# Altium schematic sheet haptic_hands.SchDoc
size A3; SheetNumber: 1; SheetTotal: 1; SPICEModelCacheEDLRRATN: <root> / <DocumentId>EDLRRATN</DocumentId> / <CacheFrame Number="0"> / <Model Name="2n3904" Kind="MDL"> / <Text>*2N3904 / *Si 310mW  40V 200mA 300MHz pkg:TO-92B 1,2,3 / .MODEL 2N3904 NPN(IS=1.4E-14 BF=300 VAF=100 IKF=0.025 ISE=3E-13 / + BR=7.5 RC=2.4 CJE=4.5E-12 TF=4E-10 CJC=3.5E-12 TR=2.1E-8 XTB=1.5 KF=9E-16 )</Text> / </Model> / </CacheFrame> / </root>
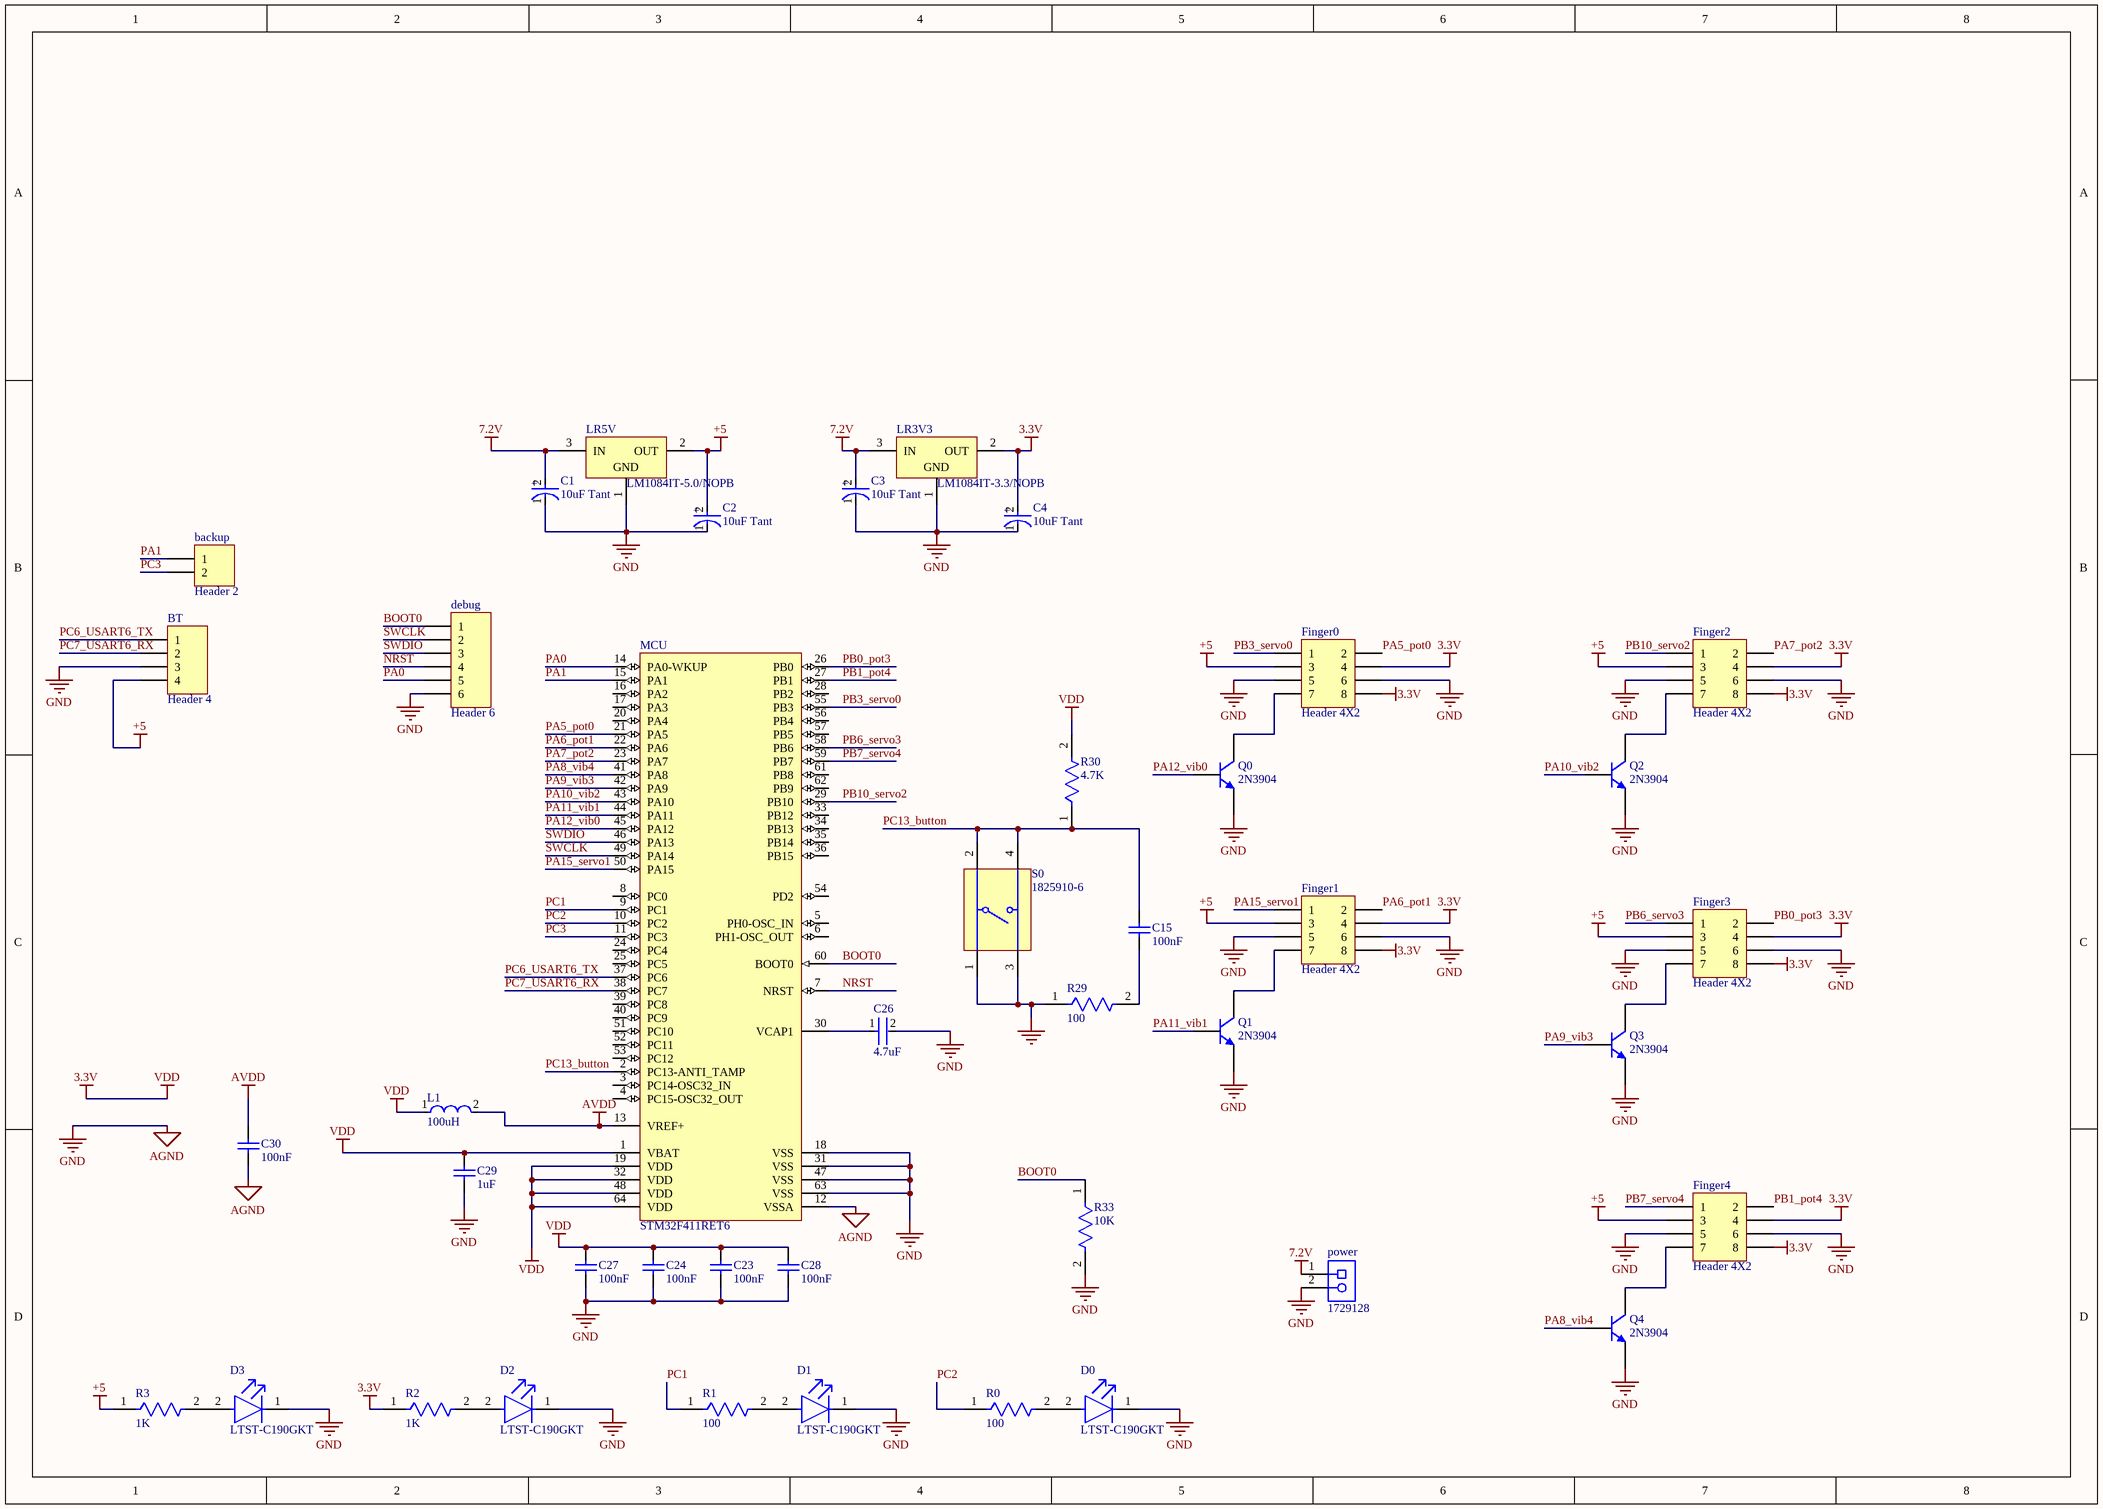
[diagram p0: haptic_hands.SchDoc]

## Parts
backup  Header 2  [HDR1X2]
BT  Header 4  [HDR1X4]
C1  10uF Tant  [FP-T491A105K016AT-MFG]
C2  10uF Tant  [FP-T491A105K016AT-MFG]
C3  10uF Tant  [FP-T491A105K016AT-MFG]
C4  10uF Tant  [FP-T491A105K016AT-MFG]
C15  100nF  [CAPC1608X92X38NL15T08]
C23  100nF  [CAPC1608X92X38NL15T08]
C24  100nF  [CAPC1608X92X38NL15T08]
C26  4.7uF  [FP-GCJ31C-0_3-IPC_A]
C27  100nF  [CAPC1608X92X38NL15T08]
C28  100nF  [CAPC1608X92X38NL15T08]
C29  1uF  [CAPC1005X56X25ML10T15]
C30  100nF  [CAPC1608X92X38NL15T08]
D0  LTST-C190GKT  [FP-LTST-C190GKT-MFG]
D1  LTST-C190GKT  [FP-LTST-C190GKT-MFG]
D2  LTST-C190GKT  [FP-LTST-C190GKT-MFG]
D3  LTST-C190GKT  [FP-LTST-C190GKT-MFG]
debug  Header 6  [HDR1X6]
Finger0  Header 4X2  [HDR2X4]
Finger1  Header 4X2  [HDR2X4]
Finger2  Header 4X2  [HDR2X4]
Finger3  Header 4X2  [HDR2X4]
Finger4  Header 4X2  [HDR2X4]
L1  100uH  [FP-LBM2016-1_6-0_2-IPC_A]
LR3V3  LM1084IT-3.3/NOPB  [NDE0003A]
LR5V  LM1084IT-5.0/NOPB  [NDE0003A]
MCU  STM32F411RET6  [STM-LQFP64_L]
power  1729128  [PHOE-1729128-2_V]
Q0  2N3904  [TO-92A]
Q1  2N3904  [TO-92A]
Q2  2N3904  [TO-92A]
Q3  2N3904  [TO-92A]
Q4  2N3904  [TO-92A]
R0  100  [FP-CR1206-IPC_A]
R1  100  [FP-CR1206-IPC_A]
R2  1K  [FP-CR1206-IPC_A]
R3  1K  [FP-CR1206-IPC_A]
R29  100  [FP-CR1206-IPC_A]
R30  4.7K  [FP-CR1206-IPC_A]
R33  10K  [FP-CR1206-IPC_A]
S0  1825910-6  [TECO-1825910-6_V]

## Nets
3.3V: C4.2(A) C23.2 C24.2 C27.2 C28.2 C29.2 Finger0.4 Finger0.8 Finger1.4 Finger1.8 Finger2.4 Finger2.8 Finger3.4 Finger3.8 Finger4.4 Finger4.8 L1.1 LR3V3.2(OUT) MCU.1(VBAT) MCU.19(VDD) MCU.32(VDD) MCU.48(VDD) MCU.64(VDD) R2.1 R30.2  [also labelled VDD]
7.2V: C1.2(A) C3.2(A) LR3V3.3(IN) LR5V.3(IN) power.1
+5: BT.4 C2.2(A) Finger0.3 Finger1.3 Finger2.3 Finger3.3 Finger4.3 LR5V.2(OUT) R3.1
AGND: BT.3 C1.1(C) C2.1(C) C3.1(C) C4.1(C) C23.1 C24.1 C26.2 C27.1 C28.1 C29.1 C30.1 D0.1(C) D1.1(C) D2.1(C) D3.1(C) debug.6 Finger0.5 Finger0.6 Finger1.5 Finger1.6 Finger2.5 Finger2.6 Finger3.5 Finger3.6 Finger4.5 Finger4.6 LR3V3.1(GND) LR5V.1(GND) MCU.12(VSSA) MCU.18(VSS) MCU.31(VSS) MCU.47(VSS) MCU.63(VSS) power.2 Q0.1(E) Q1.1(E) Q2.1(E) Q3.1(E) Q4.1(E) R29.1 R33.2 S0.1 S0.3  [also labelled GND]
AVDD: C30.2 L1.2 MCU.13(VREF+)
BOOT0: debug.1 MCU.60(BOOT0) R33.1
NRST: debug.4 MCU.7(NRST)
PA0: debug.5 MCU.14(PA0-WKUP)
PA1: backup.1 MCU.15(PA1)
PA5_pot0: Finger0.2 MCU.21(PA5)
PA6_pot1: Finger1.2 MCU.22(PA6)
PA7_pot2: Finger2.2 MCU.23(PA7)
PA8_vib4: MCU.41(PA8) Q4.2(B)
PA9_vib3: MCU.42(PA9) Q3.2(B)
PA10_vib2: MCU.43(PA10) Q2.2(B)
PA11_vib1: MCU.44(PA11) Q1.2(B)
PA12_vib0: MCU.45(PA12) Q0.2(B)
PA15_servo1: Finger1.1 MCU.50(PA15)
PB0_pot3: Finger3.2 MCU.26(PB0)
PB1_pot4: Finger4.2 MCU.27(PB1)
PB3_servo0: Finger0.1 MCU.55(PB3)
PB6_servo3: Finger3.1 MCU.58(PB6)
PB7_servo4: Finger4.1 MCU.59(PB7)
PB10_servo2: Finger2.1 MCU.29(PB10)
PC1: MCU.9(PC1) R1.1
PC2: MCU.10(PC2) R0.1
PC3: backup.2 MCU.11(PC3)
PC6_USART6_TX: BT.1 MCU.37(PC6)
PC7_USART6_RX: BT.2 MCU.38(PC7)
PC13_button: C15.2 MCU.2(PC13-ANTI_TAMP) R30.1 S0.2 S0.4
SWCLK: debug.2 MCU.49(PA14)
SWDIO: debug.3 MCU.46(PA13)
NetC15_1: C15.1 R29.2
NetC26_1: C26.1 MCU.30(VCAP1)
NetD0_2: D0.2(A) R0.2
NetD1_2: D1.2(A) R1.2
NetD2_2: D2.2(A) R2.2
NetD3_2: D3.2(A) R3.2
NetFinger0_7: Finger0.7 Q0.3(C)
NetFinger1_7: Finger1.7 Q1.3(C)
NetFinger2_7: Finger2.7 Q2.3(C)
NetFinger3_7: Finger3.7 Q3.3(C)
NetFinger4_7: Finger4.7 Q4.3(C)

Not connected (* = marked no-connect by the designer): MCU 3(PC14-OSC32_IN) 4(PC15-OSC32_OUT) 5(PH0-OSC_IN) 6(PH1-OSC_OUT) 8(PC0) 16(PA2) 17(PA3) 20(PA4) 24(PC4) 25(PC5) 28(PB2) 33(PB12) 34(PB13) 35(PB14) 36(PB15) 39(PC8) 40(PC9) 51(PC10) 52(PC11) 53(PC12) 54(PD2) 56(PB4) 57(PB5) 61(PB8) 62(PB9)

## Notes on the sheet
- (in symbol CMP-2000-07186-2) +

## Library data of the parts
backup = Header 2: Header, 2-Pin; LatestRevisionDate: 17-Jul-2002; LatestRevisionNote: Re-released for DXP Platform.; Publisher: Altium Limited
BT = Header 4: Header, 4-Pin; LatestRevisionDate: 17-Jul-2002; LatestRevisionNote: Re-released for DXP Platform.; Publisher: Altium Limited
C1-C4 = CMP-2000-07186-2: 10uF TANTALUM / T494A106K016AT; Tolerance: 20%; Ripple Current: 87mA; Capacitance: 1uF; Voltage: 16V; Life (Hours): 2000Hour; Dissipation Factor: 4%; ESR (Equivalent Series Resistance): 10R; Leakage Current: 500nA; Polarity: Polar; Lead Free: Lead Free; Min Operating Temperature: -55°C; Number of Pins: 2; Dielectric Material: Tantalum; Mount: Surface Mount; Voltage Rating: 16V; Case Code (Imperial): 1206; Length: 3.2mm; Height: 1.6mm; Features: General Purpose; Max Operating Temperature: 125°C; Package Quantity: 1; REACH SVHC: No SVHC; Termination: SMD/SMT; Depth: 1.6mm; Width: 1.6mm; Packaging: Tape and Reel; Case Code (Metric): 3216; Case/Package: 1206; Voltage Rating (DC): 16V; Height - Seated (Max): 0.071inch
C15 C23 C24 C27 C28 C30 = CMP-2006-01975-1: Manufacturer: Vitramon; Part Number: VJ0603Y104KXAAC
C26 = CMP-06035-047309-1: Cap Ceramic 4.7uF 25V X7R 10% Pad SMD 1206 Soft Termination  +125°C Automotive T/R; Max Operating Temperature: 125°C; Mount: Surface Mount; Capacitance: 4.7uF; Features: Soft Termination; Thickness: 0.075inch; Dielectric: X7R; Tolerance: 10%; Termination: SMD/SMT; Ratings: AEC-Q200; Length: 0.126inch; Case Code (Imperial): 1206; Voltage Rating (DC): 25V; Lead Free: Lead Free; Case Code (Metric): 3216; Package Quantity: 2000; Min Operating Temperature: -55°C; Case/Package: 1206; Width: 0.063inch; Voltage Rating: 25V; Packaging: Tape and Reel; Depth: 1.6mm
C29 = CMP-2008-02844-1: Part Number: 0402YD105KAT2A; Manufacturer: AVX Interconnect / Elco
D0-D3 = CMP-22017-000005-2: LED GREEN CLEAR CHIP SMD; Dominant Wavelength: 569nm; Reverse Voltage: 5V; Lens Color: Colorless; Viewing Angle: 130°; Voltage: 2V; Forward Current: 30mA; Power Dissipation: 100mW; Luminous Intensity: 6mcd; Number of LEDs: 1; Forward Voltage: 2.1V; Wavelength: 565nm; Test Current: 10mA; Min Operating Temperature: -55°C; Lens Style: Clear; Mount: Surface Mount; Width: 0.8mm; Packaging: Tape and Reel; Lens Transparency: Clear; Case Code (Metric): 1608; Depth: 0.8mm; Case Code (Imperial): 0603; Case/Package: 0603; Number of Pins: 2; Max Operating Temperature: 85°C; Lead Free: Lead Free; Number of Elements: 1; Length: 1.6mm; Height: 0.8mm; Package Quantity: 1; Power Rating: 100mW; Radiation Hardening: No; Illumination Color: Green; Color: Green
debug = Header 6: Header, 6-Pin; LatestRevisionDate: 17-Jul-2002; LatestRevisionNote: Re-released for DXP Platform.; Publisher: Altium Limited
Finger0-Finger4 = Header 4X2: Header, 4-Pin, Dual row; LatestRevisionDate: 17-Jul-2002; LatestRevisionNote: Re-released for DXP Platform.; Publisher: Altium Limited
L1 = CMP-14484-000443-1: SMD Inductors 100uH ±5% 0.08A 10.4Ω 0806
LR3V3 = CMP-0062-02533-3: 5A Low Dropout Positive Regulators, 3-pin TO-220, Pb-Free; Manufacturer: Texas Instruments; PowerWise: N; PackageTopMarking: NSUZXYTTE#*LM1084*IT-3.3; CompType: LDO IC; ComponentLink1Description: Datasheet URL; PackageReference: NDE0003A; PinCount: 3; RoHS: Y; ComponentLink1URL: http://www.ti.com/general/docs/lit/getliterature.tsp?genericPartNumber=LM1084&fileType=pdf; PackageDescription: TO-220, Molded, 3 Lead, Straight
LR5V = CMP-0062-02537-3: 5A Low Dropout Positive Regulators, 3-pin TO-220, Pb-Free; Manufacturer: Texas Instruments; PowerWise: N; PackageTopMarking: NSUZXYTTE#*LM1084*IT-5.0; CompType: LDO IC; PackageDescription: TO-220, Molded, 3 Lead, Straight; ComponentLink1URL: http://www.ti.com/general/docs/lit/getliterature.tsp?genericPartNumber=LM1084&fileType=pdf; PackageReference: NDE0003A; RoHS: Y; PinCount: 3; ComponentLink1Description: Datasheet URL
MCU = CMP-0243-00169-1: ARM Cortex-M4 32-bit MCU+FPU, 512 KB Flash, 128 KB RAM, 50 I/Os, 64-Pin LQFP, -40 to 85 degC, Tray; Operating Frequency(F) (Processor speed) (MHz): 100; FLASH Size (Prog) (kB): 512; Supply Voltage(Vcc) min (V): 1.7; Internal RAM Size (kB): 128; I/Os (High Current): 50; Packing: Tray; ComponentLink1Description: Manufacturer URL; Package Description: LQFP64; DatasheetVersion: Rev. 6; Mounting Technology: Surface Mount; Package Reference: 64-Pin Low-profile Quad Flat Package, Body 10 x 10 mm, Pitch 0.5 mm; ComponentLink2Description: Datasheet; Core: ARM Cortex-M4; ComponentLink2URL: http://www.st.com/st-web-ui/static/active/en/resource/technical/document/datasheet/DM00115249.pdf; ComponentLink1URL: http://www.st.com/
power = CMP-2000-05815-1: PCB Terminal Block, 13.5 A, 400 V, 2-Pin THD, RoHS, Bulk; Manufacturer: Phoenix Contact; Package Version: 03/2015; No. of Rows: 1; Pitch: 5.08mm; No. of Positions: 2; Voltage Rating: 400V; Current Rating: 13500mA; Manufacturer URL: http://www.phoenixcontact.com/; Datasheet URL: https://datasheet.ciiva.com/16046/1729128-16046181.pdf; RoHS: TRUE; Package URL: https://www.phoenixcontact.com/online/portal/pi/pxc/product_detail_page/!ut/p/b1/3VdJjqNKFDxLH8AFycySyWY2ozFsEPOMMQaDOX1XedGL_1Vdm5YXJleknhSKeBkvI6EA8ncAo3AYoDhBQGco6KN7VURTdemj9us_IEKEZo_YHiPAEWEFmDGOHMORkqKYCORBZxgL7ZoaZYcbFFUZ3fqxSY6GOuxydWUuHqz1ynmMFygu583Bob0Ewr6Sd_l-5m-kAueHiB0jpRwZwe58wwtkpxtMYd_LmGcDRU02dRNEyWt6Y2ti5pSyJ_reIkzIulrqApdnbT11V5jnCKbYNCvhEM1MCpPByat_X379-iThf08CI5GfOPqfBeS3BRoBOdD55AKVv0iLwCMq-2BrzXWSGRH7pUGD9uwXQjiph3xL0DKQwdGa0JImiIOmBNOestqgwTHSSs2oOep-78apyXQBvNi8ZLaFjvjWvcaUEBu0MC6Wbe-d6mB0FAebo2lUWinqYaZs5DAYzV0RP9yitUjnGJ0iI9xhZkT42OCQNUJJhkgWINNQLP2JFP6OpMg3JCVg70jqHT0lvKOnhHf0lPuOnnLf0VPuWx6_dxwUIvwk5WMkT0kLL1mh61l2yZVSzG3pYV_bqo-mj6uMKwKwdnnW8Jh5RTOJzMOA5c-eJDaZQw4mTMPH02PvS_ZAqNVjVTo2WyYLkwH_KU1mmmG5kjRhDqPXLwwVHvVOjCM60-fpXvTDfMGW1PVFVS1r4e4yVDk4ZdNbkUHvqPqQSeian4UD39fNKmachqdJ1NJbyk8rXT9mXTvPk3oE5meulKGgiruPJek-4I9hTT6G8ZLOyRSm2RRVbThERQad5OS28hdt4YW4vG0stgYYzsWsK4_7y6DZMjJSCqri1kyiZR5vD7pwIrNR7QwPHTcLTI5qT7eRlpHrdGiupYlqQDJ7zy_CND8fWWBoLRXxk1RVcXiBQwbTD4Xi7KL-FuO94t9xaqweXzH; PartNumber: 1729128; Package Description: 2-Pin Through Hole Device, Body 8.1 x 10.16 mm, Pitch 5.08 mm; Datasheet Version: 12/2013; Mounting Technology: ThroughHole; Orientation: Horizontal; Package Reference: 1729128-2; Packing: Bulk
Q0-Q4 = 2N3904: NPN General Purpose Amplifier; Published: 8-Jun-2000; LatestRevisionDate: 15-Jan-2003; LatestRevisionNote: PCB Footprint 'BCY-W3/D4.7' replaced; DatasheetVersion: 1997; PackageVersion: Sep-1998; PackageReference: TO-92A; Publisher: Altium Limited; PackageDescription: TO, Flat Index; 3 In-Line, Axial Leads; Body Dia. 4.5mm; Leads 0.51 x 0.48 mm (max); ComponentLink1Description: Manufacturer Link; ComponentLink1URL: http://www.fairchildsemi.com/; ComponentLink2Description: Datasheet; ComponentLink2URL: http://www.fairchildsemi.com/ds/2N%2F2N3904.pdf
R0-R3 R29 R30 R33 = CMP-07231-002641-1: Thick Film Chip Resistors 1206 1kΩ 0.25W 1% 100ppm/°C; Voltage Rating: 200V; Max Power Dissipation: 250mW; Resistance: 1kR; REACH SVHC: No SVHC; Radiation Hardening: No; Number of Terminations: 2; Max Operating Temperature: 155°C; Temperature Coefficient: 100ppm/°C; Voltage Rating (DC): 200V; Tolerance: 1%; Composition: Thick Film; Case Code (Imperial): 1206; Mount: Surface Mount; Width: 1.6mm; Min Operating Temperature: -55°C; Height: 0.6mm; Packaging: Tape and Reel; Number of Pins: 2; Package Quantity: 1; Military Standard: Not; Length: 3.2mm; Thickness: 610um; Case Code (Metric): 3216; Case/Package: 1206; Contact Plating: Tin; Power Rating: 250mW; Termination: SMD/SMT; Depth: 1.6mm; Features: Moisture Resistant
S0 = CMP-1684-00021-1: Tact Switch, SPST-NO, 0.05 A, -35 to 85 degC, 4-Pin THD, RoHS, Bulk; Manufacturer: TE Connectivity; Maximum Contact Resistance: 100mOhm; Mechanical Life: 100000Cycles; Bushing Type: Unthreaded; Switch Configuration: OFF(ON); Maximum DC Voltage Rating: 24V; Contact Rating @ Voltage: 0.05A@24VDC; Actuator Color: Black; Body Orientation: Straight; Function: MomentaryContact; Illumination: N/R; Actuator Style: RoundButton; Actuator Material: PolybutyleneTerephthalate; Dielectric Strength: 500VAC; Pole Throw Configuration: SPST; Actuator Length: 1.4mm; Product Weight: N/A; Contact Material: CopperAlloy; Housing Material: N/A; Terminal Type: PCPins; Minimum Insulation Resistance: 100MOhm; Package Description: 4-Pin Through Hole Device, Body 5.99 x 5.99 mm, Pitch 6.5 mm; Part No: 1825910-6; Package Reference: THD; Base Material: N/A; Manufacturer URL: http://www.te.com; Contact Plating: Silver; RoHS: Yes; Datasheet Version: Rev. C9; Electrical Life: 100000Cycles; Maximum AC Voltage Rating: N/A; Thread Size: N/R; Operating Temperature: -35to85C; Mounting: ThroughHole; Dimension: 5.99x5mm; Datasheet URL: http://www.te.com/commerce/DocumentDelivery/DDEController?Action=showdoc&DocId=Customer+Drawing%7F1825910%7FC9%7Fpdf%7FEnglish%7FENG_CD_1825910_C9.pdf%7F1825910-6; Family: 1825910; Seal Location: N/A; Seal Description: N/A; Packaging: N/A